# Altium schematic sheet TIA_Soldier.SchDoc
size Tabloid; DrawnBy: Nicholas Sandor; Revision: V26C (V26.4a); SheetNumber: 4; SheetTotal: 6
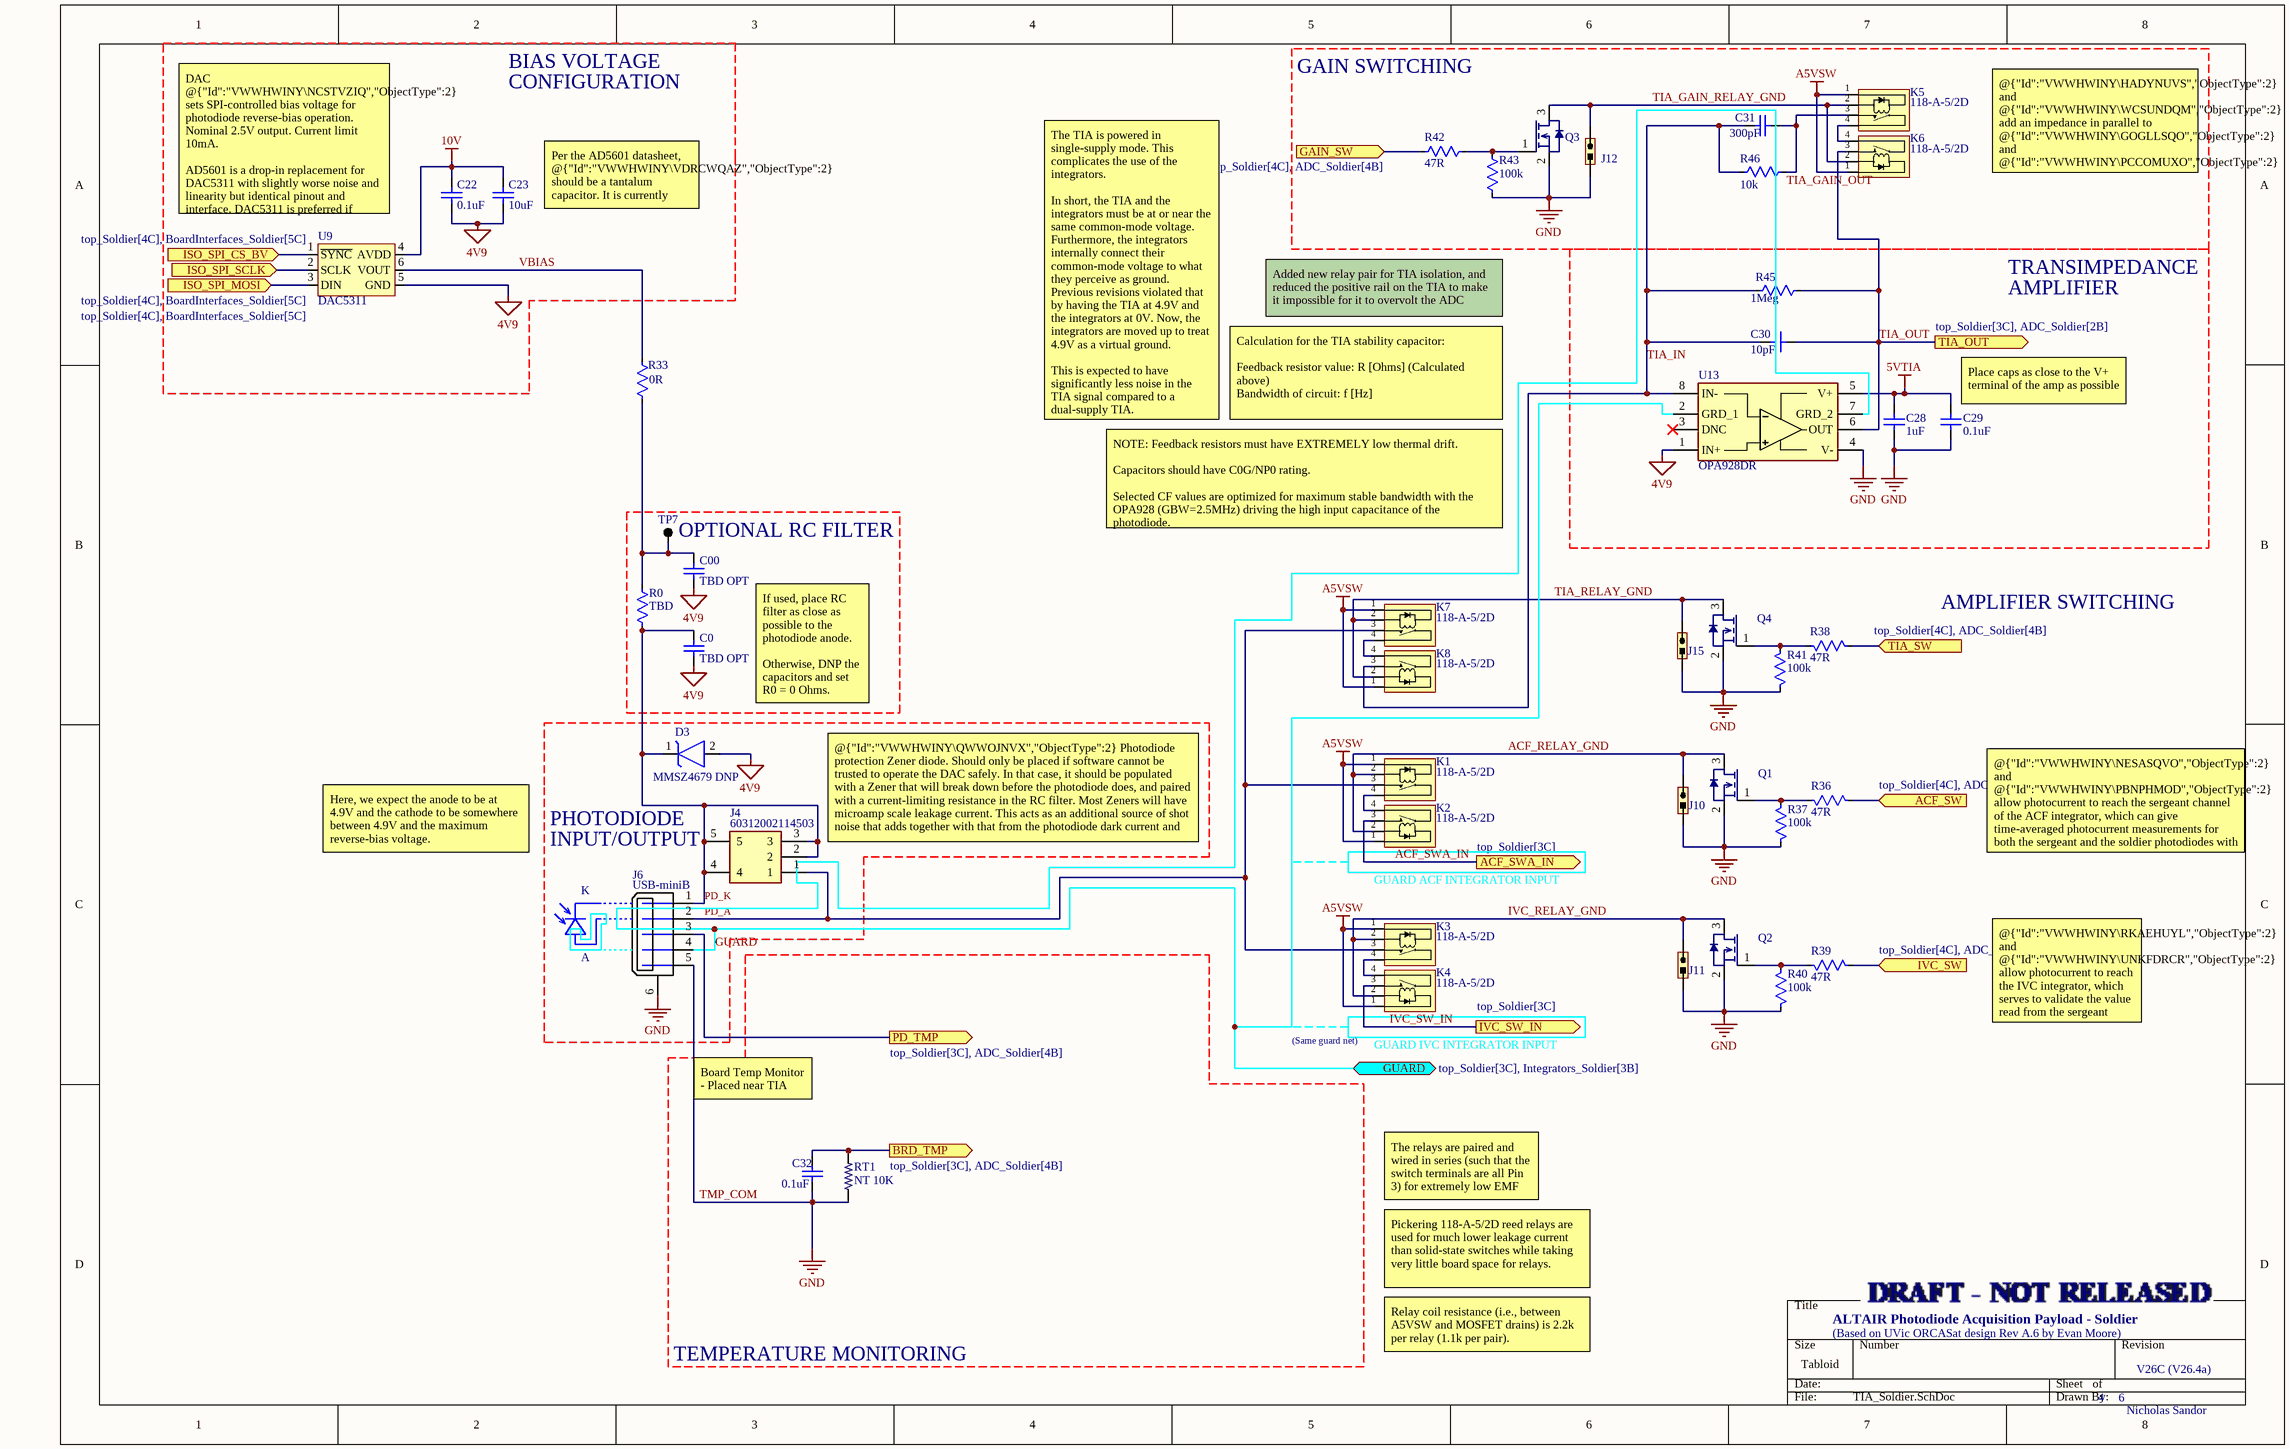
[diagram p0: TIA_Soldier.SchDoc]

## Parts
C00  TBD OPT  [CAP 0603 IPC MID DENSITY]
C0  TBD OPT  [CAP 0603 IPC MID DENSITY]
C22  0.1uF  [CAP 0603 IPC MID DENSITY]
C23  10uF  [CAP 1206 IPC LOW DENSITY]
C28  1uF  [CAP 0603 IPC MID DENSITY]
C29  0.1uF  [CAP 0603 IPC MID DENSITY]
C30  10pF  [CAP 1206 UNKNOWN]
C31  300pF  [CAP 1206 NON-IPC KEMET NP0]
C32  0.1uF  [CAP 0603 IPC MID DENSITY]
D3  MMSZ4679 DNP  [SOD-123 ONSEMI SMALL PADS]
J4  60312002114503  [COAX SMA THT]
J6  USB-miniB  [USB-miniB]
J10  Jumper  [JUMPER 2POS 1MM PITCH THT]  (value not drawn)
J11  Jumper  [JUMPER 2POS 1MM PITCH THT]  (value not drawn)
J12  Jumper  [JUMPER 2POS 1MM PITCH THT]  (value not drawn)
J15  Jumper  [JUMPER 2POS 1MM PITCH THT]  (value not drawn)
K1  118-A-5/2D  [118-A-5/2D]
K2  118-A-5/2D  [118-A-5/2D]
K3  118-A-5/2D  [118-A-5/2D]
K4  118-A-5/2D  [118-A-5/2D]
K5  118-A-5/2D  [118-A-5/2D]
K6  118-A-5/2D  [118-A-5/2D]
K7  118-A-5/2D  [118-A-5/2D]
K8  118-A-5/2D  [118-A-5/2D]
Q1  DMG2302UK  [SOT90-3 LOW DENSITY]  (value not drawn)
Q2  DMG2302UK  [SOT90-3 LOW DENSITY]  (value not drawn)
Q3  DMG2302UK  [SOT90-3 LOW DENSITY]  (value not drawn)
Q4  DMG2302UK  [SOT90-3 LOW DENSITY]  (value not drawn)
R0  TBD  [RES 0603 IPC MID DENSITY]
R33  0R  [RES 0603 IPC MID DENSITY]
R36  47R  [RES 0603 IPC MID DENSITY]
R37  100k  [RES 0603 IPC MID DENSITY]
R38  47R  [RES 0603 IPC MID DENSITY]
R39  47R  [RES 0603 IPC MID DENSITY]
R40  100k  [RES 0603 IPC MID DENSITY]
R41  100k  [RES 0603 IPC MID DENSITY]
R42  47R  [RES 0603 IPC MID DENSITY]
R43  100k  [RES 0603 IPC MID DENSITY]
R45  1Meg  [RES 1206 IPC MID DENSITY]
R46  10k  [RES 1206 IPC MID DENSITY]
RT1  value NT 10K  [RES 0603 IPC MID DENSITY]  (hidden comment: NTC 0603 10K 1%)
TP7  Testpoint  [TESTPOINT THT]  (value not drawn)  (no BOM)
U9  DAC5311  [SOT363-6 MID DENSITY]
U13  OPA928DR  [8-SOIC 4MM WIDE MID DENSITY]

## Blocks framed on the sheet
GAIN SWITCHING: C31 J12 K5 K6 Q3 R42 R43 R46
OPTIONAL RC FILTER: C0 C00 R0 TP7
TEMPERATURE MONITORING: C32 RT1

## Ports
ACF_SW (in, see top_Soldier[4C], ADC_Soldier[4B]), ACF_SWA_IN (out, see top_Soldier[3C]), BRD_TMP (out, see top_Soldier[3C], ADC_Soldier[4B]), GAIN_SW (in, see top_Soldier[4C], ADC_Soldier[4B]), GUARD (bidir, see top_Soldier[3C], Integrators_Soldier[3B]), ISO_SPI_CS_BV (in, see top_Soldier[4C], BoardInterfaces_Soldier[5C]), ISO_SPI_MOSI (in, see top_Soldier[4C], BoardInterfaces_Soldier[5C]), ISO_SPI_SCLK (in, see top_Soldier[4C], BoardInterfaces_Soldier[5C]), IVC_SW (in, see top_Soldier[4C], ADC_Soldier[4B]), IVC_SW_IN (out, see top_Soldier[3C]), PD_TMP (out, see top_Soldier[3C], ADC_Soldier[4B]), TIA_OUT (out, see top_Soldier[3C], ADC_Soldier[2B]), TIA_SW (in, see top_Soldier[4C], ADC_Soldier[4B])

## Nets
4V9: C00.1 C0.1 C22.1 C23.1 D3.2(Anode) U9.5(GND) U13.1(IN+)
5VTIA: C28.2 C29.2 U13.5(V+)
10V: C22.2 C23.2 U9.4(AVDD)
A5VSW: K1.1 K2.1 K3.1 K4.1 K5.1 K6.1 K7.1 K8.1
TMP_COM: C28.1 C29.1 C32.1 J6.5 J6.6(SHLD) J10.1 J11.1 J12.1 J15.1 Q1.2(Source) Q2.2(Source) Q3.2(Source) Q4.2(Source) R37.2 R40.2 R41.2 R43.2 RT1.1 U13.4(V-)  [also labelled GND]
ACF_RELAY_GND: J10.2 K1.2 K2.2 Q1.3(Drain)
ACF_SW: R36.2 ; port ACF_SW
ACF_SWA_IN: K2.3 ; port ACF_SWA_IN
BRD_TMP: C32.2 RT1.2 ; port BRD_TMP
GAIN_SW: R42.2 ; port GAIN_SW
GUARD: J6.4 U13.2(GRD_1) U13.7(GRD_2) ; port GUARD
ISO_SPI_CS_BV: U9.1(~{SYNC}) ; port ISO_SPI_CS_BV
ISO_SPI_MOSI: U9.3(DIN) ; port ISO_SPI_MOSI
ISO_SPI_SCLK: U9.2(SCLK) ; port ISO_SPI_SCLK
IVC_RELAY_GND: J11.2 K3.2 K4.2 Q2.3(Drain)
IVC_SW: R39.2 ; port IVC_SW
IVC_SW_IN: K4.3 ; port IVC_SW_IN
PD_A: J4.1 J6.2 K1.3 K3.3 K7.3
PD_K: C0.2 D3.1(Cathode) J4.2 J4.3 J4.4 J4.5 J6.1 R0.2
PD_TMP: J6.3 ; port PD_TMP
TIA_GAIN_OUT: C31.2 K5.3 R46.2
TIA_GAIN_RELAY_GND: J12.2 K5.2 K6.2 Q3.3(Drain)
TIA_IN: C30.1 C31.1 K8.3 R45.1 R46.1 U13.8(IN-)
TIA_OUT: C30.2 K6.3 R45.2 U13.6(OUT) ; port TIA_OUT
TIA_RELAY_GND: J15.2 K7.2 K8.2 Q4.3(Drain)
TIA_SW: R38.2 ; port TIA_SW
VBIAS: R33.2 U9.6(VOUT)
NetC00_2: C00.2 R0.1 R33.1 TP7.1
NetK1_4: K1.4 K2.4
NetK3_4: K3.4 K4.4
NetK5_4: K5.4 K6.4
NetK7_4: K7.4 K8.4
NetQ1_1: Q1.1(Gate) R36.1 R37.1
NetQ2_1: Q2.1(Gate) R39.1 R40.1
NetQ3_1: Q3.1(Gate) R42.1 R43.1
NetQ4_1: Q4.1(Gate) R38.1 R41.1

Not connected (* = marked no-connect by the designer): U13 3(DNC)*

## Notes on the sheet
- BIAS VOLTAGE
- CONFIGURATION
- DAC @{"Id":"VWWHWINY\NCSTVZIQ","ObjectType":2} sets SPI-controlled bias voltage for photodiode reverse-bias operation. Nominal 2.5V output. Current limit 10mA.
  AD5601 is a drop-in replacement for DAC5311 with slightly worse noise and linearity but identical pinout and interface. DAC5311 is preferred if available.
- (near C23) Per the AD5601 datasheet, @{"Id":"VWWHWINY\VDRCWQAZ","ObjectType":2} should be a tantalum capacitor. It is currently specified as an MLCC.
- @{"Id":"VWWHWINY\HADYNUVS","ObjectType":2} and @{"Id":"VWWHWINY\WCSUNDQM","ObjectType":2} add an impedance in parallel to @{"Id":"VWWHWINY\GOGLLSQO","ObjectType":2} and @{"Id":"VWWHWINY\PCCOMUXO","ObjectType":2} to lower the gain of the TIA, which measures the photocurrent in the case where the laser is not being pulsed.
- TRANSIMPEDANCE
- Added new relay pair for TIA isolation, and reduced the positive rail on the TIA to make it impossible for it to overvolt the ADC
- AMPLIFIER
- The TIA is powered in single-supply mode. This complicates the use of the integrators.
  In short, the TIA and the integrators must be at or near the same common-mode voltage. Furthermore, the integrators internally connect their common-mode voltage to what they perceive as ground. Previous revisions violated that by having the TIA at 4.9V and the integrators at 0V. Now, the integrators are moved up to treat 4.9V as a virtual ground.
  This is expected to have significantly less noise in the TIA signal compared to a dual-supply TIA.
- Calculation for the TIA stability capacitor:
  Feedback resistor value: R [Ohms] (Calculated above)
  Bandwidth of circuit: f [Hz]
  C = 1/(2pi R f) [F]
- (near C29) Place caps as close to the V+ terminal of the amp as possible
- NOTE: Feedback resistors must have EXTREMELY low thermal drift.
  Capacitors should have C0G/NP0 rating.
  Selected CF values are optimized for maximum stable bandwidth with the OPA928 (GBW=2.5MHz) driving the high input capacitance of the photodiode.
- AMPLIFIER SWITCHING
- If used, place RC filter as close as possible to the photodiode anode.
  Otherwise, DNP the capacitors and set R0 = 0 Ohms.
- Here, we expect the anode to be at 4.9V and the cathode to be somewhere between 4.9V and the maximum reverse-bias voltage.
- PHOTODIODE
- INPUT/OUTPUT
- (near J4) @{"Id":"VWWHWINY\QWWOJNVX","ObjectType":2} Photodiode protection Zener diode. Should only be placed if software cannot be trusted to operate the DAC safely. In that case, it should be populated with a Zener that will break down before the photodiode does, and paired with a current-limiting resistance in the RC filter. Most Zeners will have microamp scale leakage current. This acts as an additional source of shot noise that adds together with that from the photodiode dark current and limits measurement precision.
- GUARD ACF INTEGRATOR INPUT
- @{"Id":"VWWHWINY\NESASQVO","ObjectType":2} and @{"Id":"VWWHWINY\PBNPHMOD","ObjectType":2} allow photocurrent to reach the sergeant channel of the ACF integrator, which can give time-averaged photocurrent measurements for both the sergeant and the soldier photodiodes with nearly identical characteristics between the two.
- K
- A
- (near K4) (Same guard net)
- (near K4) GUARD IVC INTEGRATOR INPUT
- @{"Id":"VWWHWINY\RKAEHUYL","ObjectType":2} and @{"Id":"VWWHWINY\UNKFDRCR","ObjectType":2} allow photocurrent to reach the IVC integrator, which serves to validate the value read from the sergeant channel of the ACF.
- Board Temp Monitor
  - Placed near TIA
- The relays are paired and wired in series (such that the switch terminals are all Pin 3) for extremely low EMF
- Pickering 118-A-5/2D reed relays are used for much lower leakage current than solid-state switches while taking very little board space for relays.
- ALTAIR Photodiode Acquisition Payload - Soldier
- (Based on UVic ORCASat design Rev A.6 by Evan Moore)
- Relay coil resistance (i.e., between A5VSW and MOSFET drains) is 2.2k per relay (1.1k per pair).

## Library data of the parts
C00 C0 = CAP: Murata GRT188R61H105KE13D - Cap Ceramic 1uF 10% 50V X5R 0603 (Placeholder); MF: Murata; MP: GRT188R61H105KE13D
C22 C29 C32 = CAP: Kemet C0603C104K5RACAUTO - Cap Ceramic 0.1uF 50V X7R 10% 0603 125C Paper T/R; MF: Kemet; MP: C0603C104K5RACAUTO
C23 = CAP: Murata GRT319R6YA106KE01D - Cap Ceramic 10uF 35V X5R 10% Pad SMD 1206 85C Automotive T/R; MF: Murata; MP: GRT319R6YA106KE01D
C28 = CAP: Murata GRT188R61H105KE13D - Cap MLCC AEC-Q200 X5R 1uF 50V 0603; MF: Murata; MP: GRT188R61H105KE13D
C30 = CAP: Wurth Elektronik 885012008037 - Cap Ceramic 10pF 5% 50V NP0 1206; MF: Wurth Elektronik; MP: 885012008037
C31 = CAP: Kemet C1206C301K5GACTU - Cap Ceramic 300pF 10% 50V NP0 1206; MF: Kemet; MP: C1206C301K5GACTU
D3 = Zener: DIODE ZENER SOD123; MF: onsemi; MP: MMSZ4679T1G
J4 = 60312002114503: Coaxial, SMA Female Jack, 50 Ohm, Through-Hole; MF: Wurth Elektronik; Datasheet Link: https://katalog.we-online.de/em/datasheet/60312002114503.pdf; Height: 9.56mm; MP: 60312002114503; Mouser Part Number: 710-60312002114503; Mouser Price/Stock: https://www.mouser.co.uk/ProductDetail/Wurth-Elektronik/60312002114503?qs=3jNSNtuqJTL%2FGpZA1FAOxw%3D%3D
J6 = USB-miniB: Conn Mini-USB RCP 5 POS Solder ST Thru-Hole 5 Terminal 1 Port; Number of Positions: 5; Gender: Female; MF: Amphenol Commercial; MP: UE25BE5510H; RoHS: Yes; Category: USB Connectors; Stock 1: 6446; Mount: Through Hole; Color: Black; Contact Material: Copper Alloy; Contact Plating: Gold; Number of Contacts: 5; Termination: PCB; Features: High Temperature; Lead Free: Lead Free; Flammability Rating: UL94 V-0; ComponentLink1URL: http://components.arrow.com/part/dataview/0323_00956300?src-supplier=Arrow+Europe; ComponentLink1Description: http://components.arrow.com/part/dataview/0323_00956300?src-supplier=Arrow+Europe; ComponentLink2URL: http://www.alliedelec.com/m/d/e7e3d7a920045eebbdef787e60d8b001.pdf?src-supplier=Allied+Electronics; ComponentLink2Description: http://www.alliedelec.com/m/d/e7e3d7a920045eebbdef787e60d8b001.pdf?src-supplier=Allied+Electronics; ComponentLink3URL: https://www.amphenolcanada.com/ProductSearch/drawings/AC/UE25BEX510X.pdf?src-supplier=Digi-Key; ComponentLink3Description: https://www.amphenolcanada.com/ProductSearch/drawings/AC/UE25BEX510X.pdf?src-supplier=Digi-Key; Supplier 1: Digi-Key; Supplier Part Number 1: UE25BE5510H-ND
J10-J12 J15 = Jumper 2POS: Header 2Pos THT 2.54mm Pitch; MF: Samtec Inc.; MP: TSW-101-23-G-D; Supplier 1: Digi-Key; Supplier Part Number 1: SAM1068-01-ND; Operating Temperature: -55°C ~ 125°C
K1-K8 = RELAY 118-A-5/2D: High coil resistance SIL/SIP Reed Relay 118-A-5/2D; MF: Pickering; MP: 118-1-A-5/2D
Q1-Q4 = NMOS DMG2302UK: DIODES INC. Power MOSFET, N Channel, 20 V, 2.8 A, 0.061 ohm, SOT-23, Surface Mount; MP: DMG2302UK-7; ComponentLink1URL: http://www.farnell.com/datasheets/2814387.pdf?src-supplier=Farnell; ComponentLink1Description: http://www.farnell.com/datasheets/2814387.pdf?src-supplier=Farnell; ComponentLink2URL: http://www.farnell.com/datasheets/2814387.pdf?src-supplier=Element14; ComponentLink2Description: http://www.farnell.com/datasheets/2814387.pdf?src-supplier=Element14; ComponentLink3URL: https://www.diodes.com/assets/Datasheets/DMG2302UK.pdf?src-supplier=Digi-Key; ComponentLink3Description: https://www.diodes.com/assets/Datasheets/DMG2302UK.pdf?src-supplier=Digi-Key; ComponentLink4URL: http://www.farnell.com/datasheets/2814387.pdf?src-supplier=Newark; ComponentLink4Description: http://www.farnell.com/datasheets/2814387.pdf?src-supplier=Newark; Supplier 1: Digi-Key; Supplier Part Number 1: DMG2302UK-7DICT-ND; MF: Diodes
R0 = RES: Yageo RC0402JR-070RL - Res 0 Ohms 1/16W SMD 0402; MF: YAGEO; MP: RC0402JR-070RL
R33 = RES: Vishay CRCW06030000Z0EA - Res 0 Ohms 1/8W SMD 0603; MF: Vishay Dale; MP: CRCW06030000Z0EA
R36 R38 R39 R42 = RES: Vishay CRCW060347R0JNEA - Res 47Ohm 5% 1/8W SMD 0603; MF: Vishay Dale; MP: CRCW060347R0JNEA
R37 R40 R41 R43 = RES: Panasonic ERJ-3GEYJ104V - Res 100k 5% 1/10W SMD 0603; MF: Panasonic Electronic Components; MP: ERJ-3GEYJ104V
R45 = RES: Vishay TNPV12061M00BYEN - Res 1MOhm 0.1% 1/4W SMD 1206; MF: Vishay Dale; MP: TNPV12061M00BYEN
R46 = RES: Stackpole RNCF1206TKY10K0 - Res 10k 0.01% 1/4W SMD 1206; MF: Stackpole Electronics Inc.; MP: RNCF1206TKY10K0
RT1 = THERM_RES NTC 0603 10K 1%: THERMISTOR NTC 10KOHM 3380K 0603; MF: Murata; MP: NCU18XH103F60RB; RoHS: No; Category: Thermistors; Stock 1: 48580; Case/Package: 0603; Case Code (Metric): 1608; Case Code (Imperial): 0603; Min Operating Temperature: -40°C; Max Operating Temperature: 125°C; REACH SVHC: No SVHC; ComponentLink1URL: http://www.farnell.com/datasheets/2095755.pdf?src-supplier=Farnell; ComponentLink1Description: http://www.farnell.com/datasheets/2095755.pdf?src-supplier=Farnell; ComponentLink2URL: https://www.murata.com/en-us/products/productdata/8796836233246/L0770E.pdf?src-supplier=Digi-Key; ComponentLink2Description: https://www.murata.com/en-us/products/productdata/8796836233246/L0770E.pdf?src-supplier=Digi-Key; ComponentLink3URL: http://www.farnell.com/datasheets/2095755.pdf?src-supplier=Element14; ComponentLink3Description: http://www.farnell.com/datasheets/2095755.pdf?src-supplier=Element14; Supplier 1: Digi-Key; Supplier Part Number 1: 490-16279-1-ND
U9 = DAC5311: DAC 8bit 1 channel SPI Supply Reference Buffered Voltage; MF: Texas Instruments; MP: DAC5311IDCKR
U13 = OPA928DR: Op Amp, 36V, fA input, precision, e-trim; MF: Texas Instruments; Datasheet Link: https://www.ti.com/lit/ds/symlink/opa928.pdf?HQS=dis-mous-null-mousermode-dsf-pf-null-wwe&ts=1731036524091&ref_url=https%253A%252F%252Fwww.ti.com%252Fgeneral%252Fdocs%252Fsuppproductinfo.tsp%253FdistId%253D26%2526gotoUrl%253Dhttps%253A%252F%252Fwww.ti.com; Height: 1.75mm; MP: OPA928DR; Mouser Part Number: 595-OPA928DR; Mouser Price/Stock: https://www.mouser.co.uk/ProductDetail/Texas-Instruments/OPA928DR?qs=2wMNvWM5ZX5RgAZJHoeYSw%3D%3D; Arrow Part Number: OPA928DR; Arrow Price/Stock: null?region=nac